# EAGLE design polarshield3.0d (EAGLE 7.2.0)
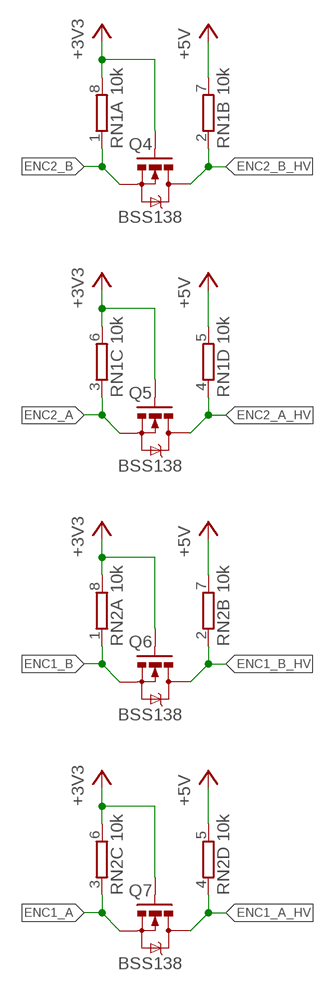
[diagram p0: schematic, sheet 1, part 1 of 2]
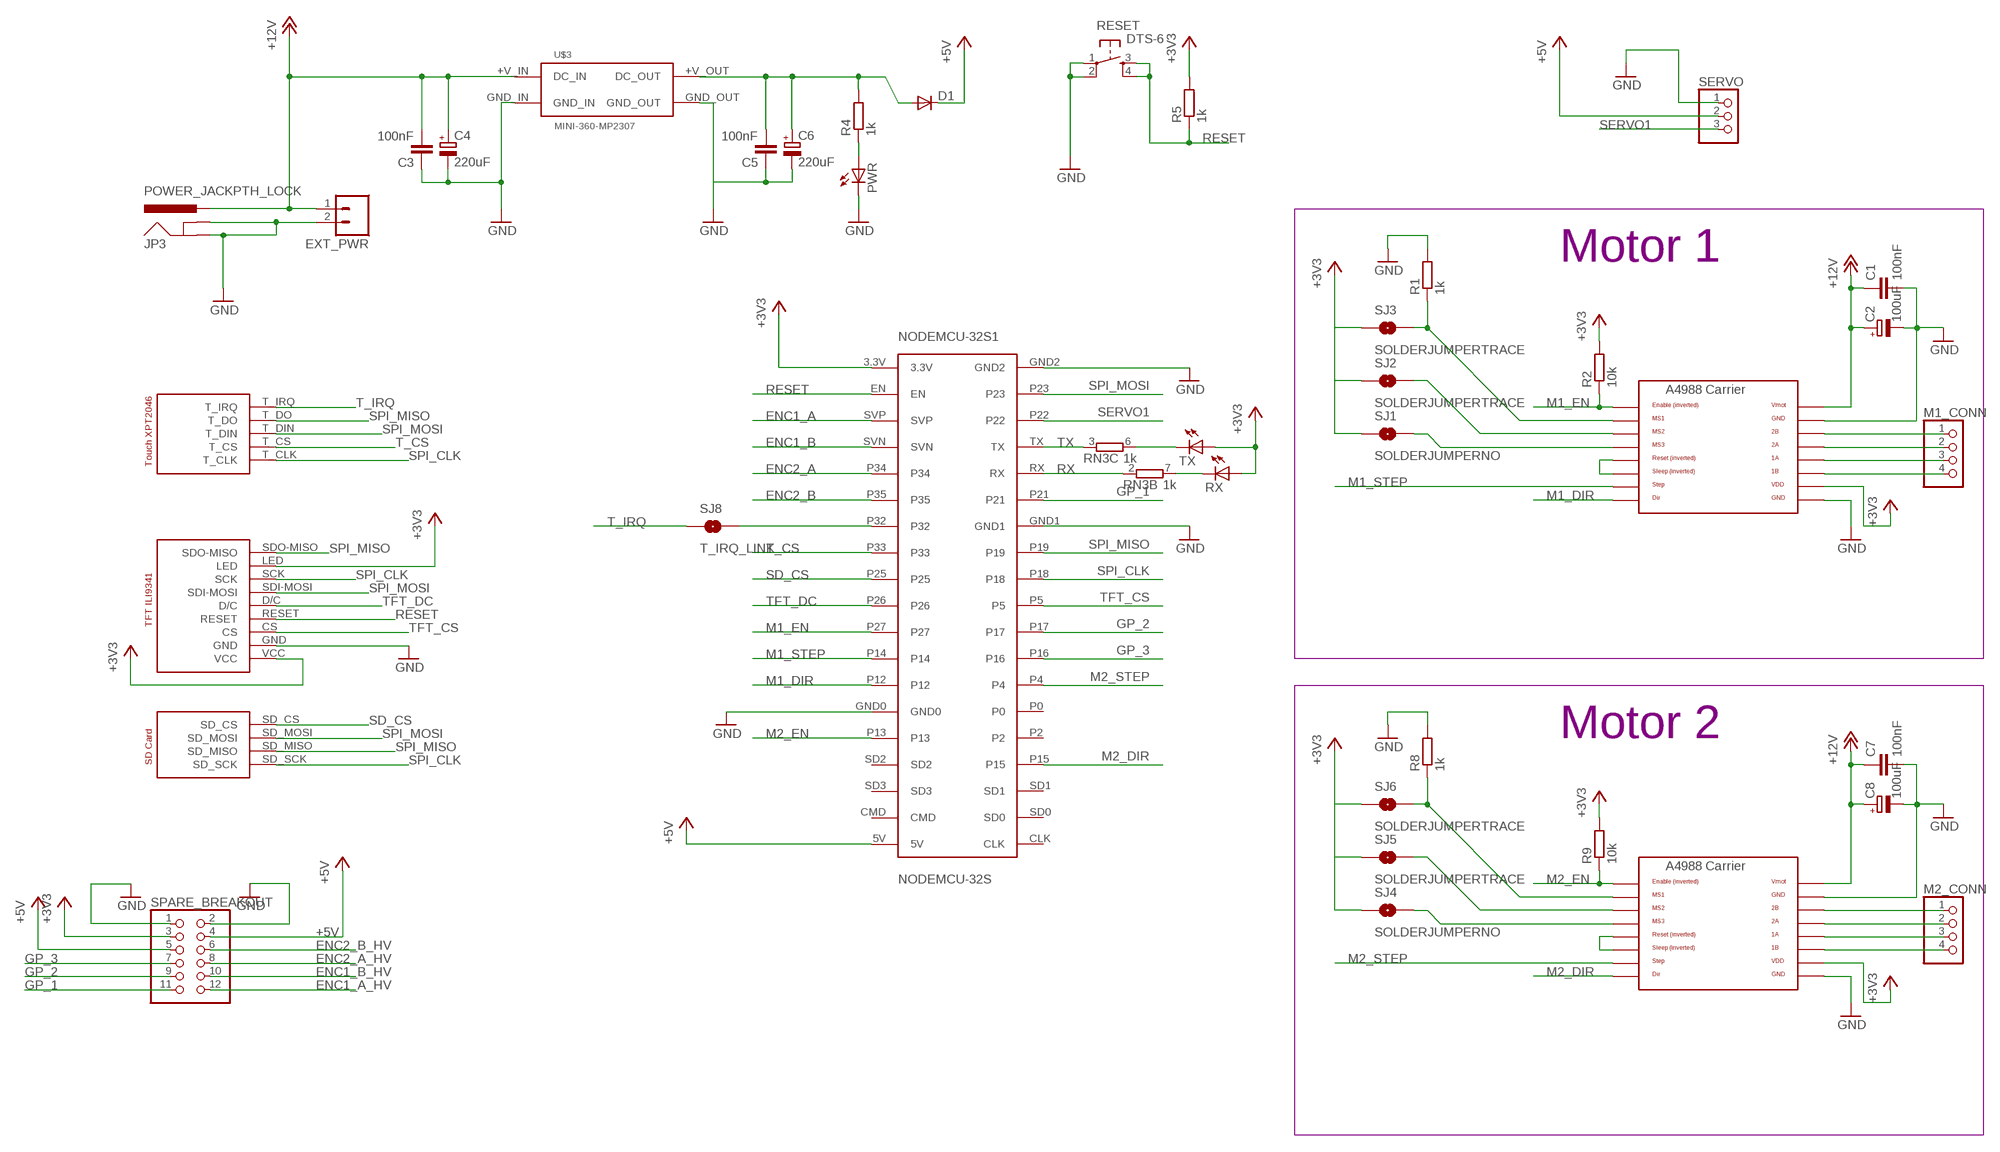
[diagram p1: schematic, sheet 1, part 2 of 2]

## Parts
C1  100nF  C-EUC0805  [C0805]
C2  100uF  CPOL-EU153CLV-0605  [153CLV-0605]
C3  100nF  C-EUC0805  [C0805]
C4  220uF  CPOL-EU153CLV-0605  [153CLV-0605]
C5  100nF  C-EUC0805  [C0805]
C6  220uF  CPOL-EU153CLV-0605  [153CLV-0605]
C7  100nF  C-EUC0805  [C0805]
C8  100uF  CPOL-EU153CLV-0605  [153CLV-0605]
D1  DIODE-DO214BA  [DO214BA]
EXT_PWR  M02PTH  [1X02]
JP3  POWER_JACKPTH_LOCK  [POWER_JACK_PTH_LOCK]
M1_CONN  PINHD-1X4/90  [1X04/90]
M2_CONN  PINHD-1X4/90  [1X04/90]
MOTOR_1  A4988BREAKOUT  [A4988BREAKOUT]
MOTOR_2  A4988BREAKOUT  [A4988BREAKOUT]
NODEMCU-32S1  NODEMCU-32S  [NODEMCU-32S]
PWR  LEDCHIPLED_0805  [CHIPLED_0805]
Q4  BSS138  MOSFET-NCHANNELSMD  [SOT23-3]
Q5  BSS138  MOSFET-NCHANNELSMD  [SOT23-3]
Q6  BSS138  MOSFET-NCHANNELSMD  [SOT23-3]
Q7  BSS138  MOSFET-NCHANNELSMD  [SOT23-3]
R1  1k  R-EU_M0805  [M0805]
R2  10k  R-EU_M0805  [M0805]
R4  1k  R-EU_M0805  [M0805]
R5  1k  R-EU_M0805  [M0805]
R8  1k  R-EU_M0805  [M0805]
R9  10k  R-EU_M0805  [M0805]
RESET  DTS-6  [DTS-6]
RN1  10k  4R-NEXB38V  [EXB38V]
RN2  10k  4R-NEXB38V  [EXB38V]
RN3  1k  4R-NEXB38V  [EXB38V]
RX  LEDCHIPLED_0805  [CHIPLED_0805]
SERVO  PINHD-1X3/90  [1X03/90]
SJ1  SOLDERJUMPERNO  [SJ_2S-NO]
SJ2  SOLDERJUMPERTRACE  [SJ_2S-TRACE]
SJ3  SOLDERJUMPERTRACE  [SJ_2S-TRACE]
SJ4  SOLDERJUMPERNO  [SJ_2S-NO]
SJ5  SOLDERJUMPERTRACE  [SJ_2S-TRACE]
SJ6  SOLDERJUMPERTRACE  [SJ_2S-TRACE]
SJ8  T_IRQ_LINK  SOLDERJUMPERNO  [SJ_2S-NO]
SPARE_BREAKOUT  PINHD-2X6  [2X06]
TX  LEDCHIPLED_0805  [CHIPLED_0805]
U$2  2.4_TFT_SPI_TOUCH_SD  [2.4_TFT_SPI_TOUCH_SD]
U$3  MINI-360-MP2307  [MINI-360-MP2307]

## Nets
+3V3 [VCC]: MOTOR_1.VDD MOTOR_2.VDD NODEMCU-32S1.3.3V Q4.1(G) Q5.1(G) Q6.1(G) Q7.1(G) R2.2 R5.2 R9.2 RN1.6 RN1.8 RN2.6 RN2.8 RX.A SJ1.1 SJ2.1 SJ3.1 SJ4.1 SJ5.1 SJ6.1 SPARE_BREAKOUT.3 TX.A U$2.LED U$2.VCC
+5V [VCC]: D1.C NODEMCU-32S1.5V RN1.5 RN1.7 RN2.5 RN2.7 SERVO.2 SPARE_BREAKOUT.4 SPARE_BREAKOUT.5
+12V [VMOT]: C1.1 C2.+ C3.2 C4.+ C7.1 C8.+ EXT_PWR.1 JP3.PWR MOTOR_1.VMOT MOTOR_2.VMOT U$3.+V_IN(DC_IN)
ENC1_A: NODEMCU-32S1.SVP Q7.2(S) RN2.3
ENC1_A_HV: Q7.3(D) RN2.4 SPARE_BREAKOUT.12
ENC1_B: NODEMCU-32S1.SVN Q6.2(S) RN2.1
ENC1_B_HV: Q6.3(D) RN2.2 SPARE_BREAKOUT.10
ENC2_A: NODEMCU-32S1.P34 Q5.2(S) RN1.3
ENC2_A_HV: Q5.3(D) RN1.4 SPARE_BREAKOUT.8
ENC2_B: NODEMCU-32S1.P35 Q4.2(S) RN1.1
ENC2_B_HV: Q4.3(D) RN1.2 SPARE_BREAKOUT.6
GND [GND]: C1.2 C2.- C3.1 C4.- C5.1 C6.- C7.2 C8.- EXT_PWR.2 JP3.GND JP3.GNDBREAK MOTOR_1.GND MOTOR_1.GND@0(GND) MOTOR_2.GND MOTOR_2.GND@0(GND) NODEMCU-32S1.GND0 NODEMCU-32S1.GND1 NODEMCU-32S1.GND2 PWR.C R1.2 R8.2 RESET.1 RESET.2 SERVO.1 SPARE_BREAKOUT.1 SPARE_BREAKOUT.2 U$2.GND U$3.GND_IN U$3.GND_OUT
GP_1: NODEMCU-32S1.P21 SPARE_BREAKOUT.11
GP_2: NODEMCU-32S1.P17 SPARE_BREAKOUT.9
GP_3: NODEMCU-32S1.P16 SPARE_BREAKOUT.7
M1_DIR: MOTOR_1.DIR NODEMCU-32S1.P12
M1_EN: MOTOR_1.EN NODEMCU-32S1.P27 R2.1
M1_STEP: MOTOR_1.STEP NODEMCU-32S1.P14
M2_DIR: MOTOR_2.DIR NODEMCU-32S1.P15
M2_EN: MOTOR_2.EN NODEMCU-32S1.P13 R9.1
M2_STEP: MOTOR_2.STEP NODEMCU-32S1.P4
N$1: NODEMCU-32S1.P32 SJ8.2
N$2: MOTOR_1.RST MOTOR_1.SLP(SLEEP)
N$3: MOTOR_1.MS3 SJ1.2
N$4: MOTOR_1.MS2 SJ2.2
N$5: MOTOR_1.MS1 R1.1 SJ3.2
N$7 [VCC]: C5.2 C6.+ D1.A R4.2 U$3.+V_OUT(DC_OUT)
N$8: PWR.A R4.1
N$9: MOTOR_2.MS3 SJ4.2
N$10 [VMOT]: M1_CONN.1 MOTOR_1.2B
N$11 [VMOT]: M1_CONN.2 MOTOR_1.2A
N$12 [VMOT]: M1_CONN.3 MOTOR_1.1A
N$13 [VMOT]: M1_CONN.4 MOTOR_1.1B
N$14: RN3.6 TX.C
N$15: RN3.7 RX.C
N$16: MOTOR_2.MS2 SJ5.2
N$17: MOTOR_2.MS1 R8.1 SJ6.2
N$18: MOTOR_2.RST MOTOR_2.SLP(SLEEP)
N$20 [VMOT]: M2_CONN.1 MOTOR_2.2B
N$21 [VMOT]: M2_CONN.2 MOTOR_2.2A
N$22 [VMOT]: M2_CONN.3 MOTOR_2.1A
N$23 [VMOT]: M2_CONN.4 MOTOR_2.1B
RESET: NODEMCU-32S1.EN R5.1 RESET.3 RESET.4 U$2.RESET
RX: NODEMCU-32S1.RX RN3.2
SD_CS: NODEMCU-32S1.P25 U$2.SD_CS
SERVO1: NODEMCU-32S1.P22 SERVO.3
SPI_CLK: NODEMCU-32S1.P18 U$2.SCK U$2.SD_SCK U$2.T_CLK
SPI_MISO: NODEMCU-32S1.P19 U$2.SD_MISO U$2.SDO-MISO U$2.T_DO
SPI_MOSI: NODEMCU-32S1.P23 U$2.SD_MOSI U$2.SDI-MOSI U$2.T_DIN
T_CS: NODEMCU-32S1.P33 U$2.T_CS
T_IRQ: SJ8.1 U$2.T_IRQ
TFT_CS: NODEMCU-32S1.P5 U$2.CS
TFT_DC: NODEMCU-32S1.P26 U$2.D/C
TX: NODEMCU-32S1.TX RN3.3
Unconnected: NODEMCU-32S1.CLK NODEMCU-32S1.CMD NODEMCU-32S1.P0 NODEMCU-32S1.P2 NODEMCU-32S1.SD0 NODEMCU-32S1.SD1 NODEMCU-32S1.SD2 NODEMCU-32S1.SD3 RN3.1 RN3.4 RN3.5 RN3.8

## Notes on the sheet
- Motor 1
- Motor 2

## Library data of the parts
C1 C3 C5 C7 = resistor:C-EU: CAPACITOR, European symbol
C2 C4 C6 C8 = resistor:CPOL-EU: POLARIZED CAPACITOR, European symbol
D1 = diode:DIODE-: DIODE
EXT_PWR = SparkFun-Connectors:M02: Standard 2-pin 0.1" header. Use with - straight break away headers ( PRT-00116) - right angle break away headers (PRT-00553) - swiss pins (PRT-00743) - machine pins (PRT-00117) - female headers (PRT-00115) Molex polarized connector foot print use with: PRT-08233 with associated crimp pins and housings. 2.54_SCREWTERM for use with PRT-10571. 3.5mm Screw Terminal footprints for PRT-08084 5mm Screw Terminal footprints for use with PRT-08432
JP3 = SparkFun-Connectors:POWER_JACK: Power Jack This is the standard 5.5mm barrel jack for power. The PTH is the most common, proven, reliable, footprint. The Slot footprint only works if the mill layer is transmitted to the PCB fab house so be warned. Mating wall wart : TOL-00298 (and others); PROD_ID: CONN-08197; SF_ID: PRT-00119
M1_CONN M2_CONN = pinhead:PINHD-1X4: PIN HEADER
MOTOR_1 MOTOR_2 = sandy:A4988BREAKOUT
NODEMCU-32S1 = sandy:NODEMCU-32S
PWR RX TX = polargraph3:LED: LED OSRAM: - CHIPLED LG R971, LG N971, LY N971, LG Q971, LY Q971, LO R971, LY R971 LH N974, LH R974 LS Q976, LO Q976, LY Q976 LO Q996 - Hyper CHIPLED LW Q18S LB Q993, LB Q99A, LB R99A - SideLED LS A670, LO A670, LY A670, LG A670, LP A670 LB A673, LV A673, LT A673, LW A673 LH A674 LY A675 LS A676, LA A676, LO A676, LY A676, LW A676 LS A679, LY A679, LG A679 - Hyper Micro SIDELED® LS Y876, LA Y876, LO Y876, LY Y876 LT Y87S - SmartLED LW L88C, LW L88S LB L89C, LB L89S, LG L890 LS L89K, LO L89K, LY L89K LS L896, LA L896, LO L896, LY L896 - TOPLED LS T670, LO T670, LY T670, LG T670, LP T670 LSG T670, LSP T670, LSY T670, LOP T670, LYG T670 LG T671, LOG T671, LSG T671 LB T673, LV T673, LT T673, LW T673 LH T674 LS T676, LA T676, LO T676, LY T676, LB T676, LH T676, LSB T676, LW T676 LB T67C, LV T67C, LT T67C, LS T67K, LO T67K, LY T67K, LW E67C LS E67B, LA E67B, LO E67B, LY E67B, LB E67C, LV E67C, LT E67C LW T67C LS T679, LY T679, LG T679 LS T770, LO T770, LY T770, LG T770, LP T770 LB T773, LV T773, LT T773, LW T773 LH T774 LS E675, LA E675, LY E675, LS T675 LS T776, LA T776, LO T776, LY T776, LB T776 LHGB T686 LT T68C, LB T68C - Hyper Mini TOPLED® LB M676 - Mini TOPLED Santana® LG M470 LS M47K, LO M47K, LY M47K Source: http://www.osram.convergy.de LUXEON: - LUMILED® LXK2-PW12-R00, LXK2-PW12-S00, LXK2-PW14-U00, LXK2-PW14-V00 LXK2-PM12-R00, LXK2-PM12-S00, LXK2-PM14-U00 LXK2-PE12-Q00, LXK2-PE12-R00, LXK2-PE12-S00, LXK2-PE14-T00, LXK2-PE14-U00 LXK2-PB12-K00, LXK2-PB12-L00, LXK2-PB12-M00, LXK2-PB14-N00, LXK2-PB14-P00, LXK2-PB14-Q00 LXK2-PR12-L00, LXK2-PR12-M00, LXK2-PR14-Q00, LXK2-PR14-R00 LXK2-PD12-Q00, LXK2-PD12-R00, LXK2-PD12-S00 LXK2-PH12-R00, LXK2-PH12-S00 LXK2-PL12-P00, LXK2-PL12-Q00, LXK2-PL12-R00 Source: www.luxeon.com KINGBRIGHT: KA-3528ASYC Source: www.kingbright.com
Q4-Q7 = SparkFun:MOSFET-NCHANNEL
R1 R2 R4 R5 R8 R9 = resistor:R-EU_: RESISTOR, European symbol
RESET = switch-tact:DTS-6
RN1-RN3 = resistor-dil:4R-N: Array Chip Resistor Source: RS Component / Phycomp; OC_FARNELL: unknown; OC_NEWARK: unknown
SERVO = pinhead:PINHD-1X3: PIN HEADER
SJ1-SJ6 = polargraph3:SOLDERJUMPER: Solder Jumper Standard SMD solder jumper. Used to automate production. Two varients : Normally Open and Normally Closed are the same, but have different paste layers. NC will have a large amount of paste and should jumper during reflow.
SJ8 = SparkFun-Retired:SOLDERJUMPER: Solder Jumper Standard SMD solder jumper. Used to automate production. Two varients : Normally Open and Normally Closed are the same, but have different paste layers. NC will have a large amount of paste and should jumper during reflow.
SPARE_BREAKOUT = pinhead:PINHD-2X6: PIN HEADER
U$2 = polargraph3:2.4_TFT_SPI_TOUCH_SD
U$3 = polargraph3:MINI-360-MP2307

## Net classes
0 signal: width 0.254 mm, drill 0.152 mm, clearance 0.203 mm
1 VMOT: width 1.118 mm, drill 0.152 mm, clearance 0.305 mm
2 VCC: width 0.61 mm, drill 0.152 mm, clearance 0.203 mm
3 GND: width 0.305 mm, drill 0.152 mm, clearance 0.203 mm

## Board
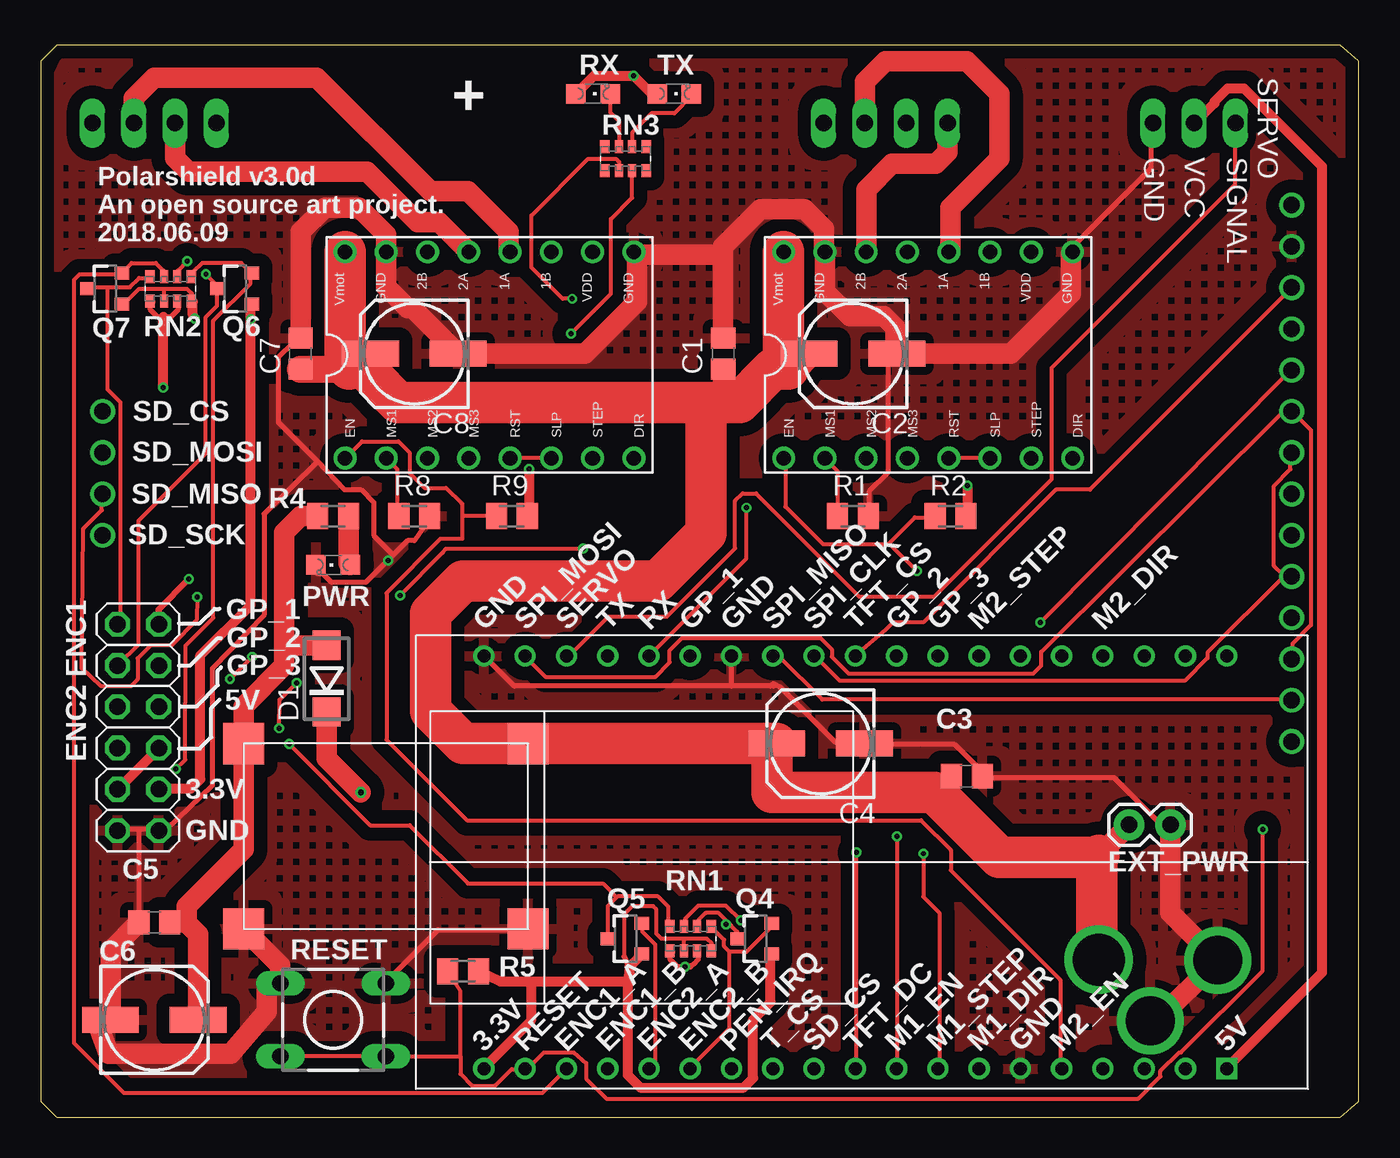
[diagram p2: board, top side]
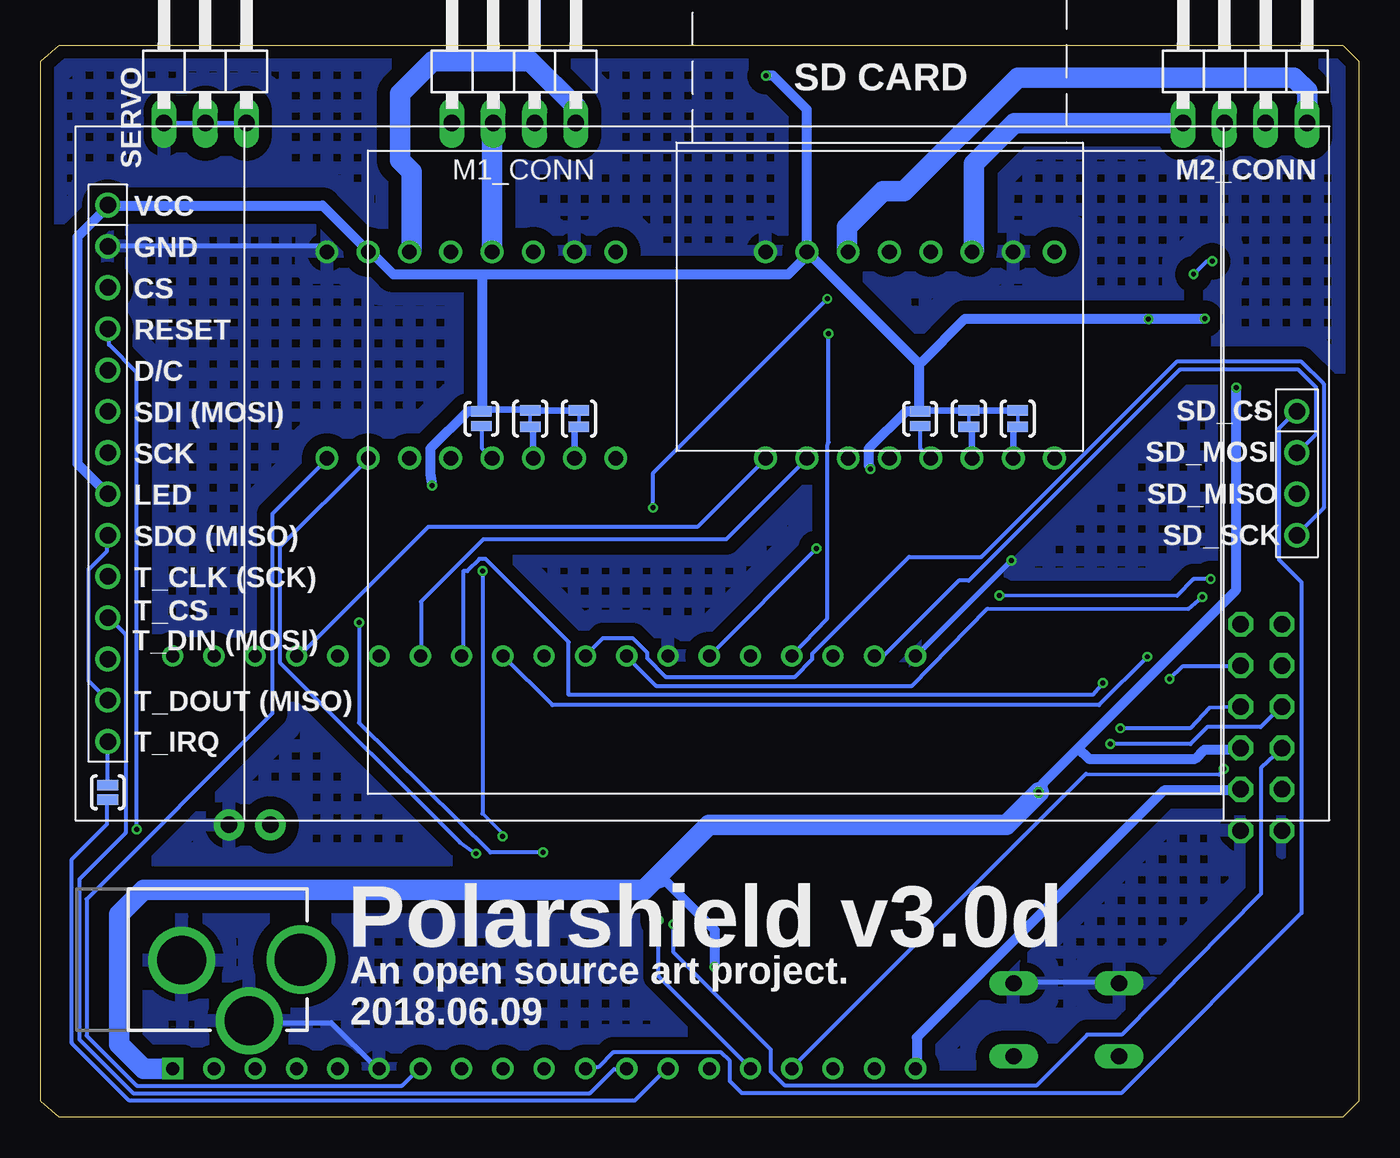
[diagram p3: board, bottom side, seen from below]

Size 81.13 x 66 mm. Coordinates in mm from the lower left corner, seen from the top.
Outline: 0,1 1,0 80,0 81.13,1 81.13,65 80,66 1,66 0,65 0,1
Copper layers (1*16): Top 0.035mm / dielectric 1.5mm / Bottom 0.035mm
Design rules "SeeedStudio_2layer_DRU_no_angle_20140221 *": minimum track width 6mil, minimum drill 12mil, track to track 6mil, track to pad 6mil, pad to pad 6mil, via to via 6mil, smd to smd 0mil, copper to edge 10mil, drill to drill 10mil, minimum pad ring 10mil, minimum via ring 6mil, stop-mask expansion 2mil, vias tented up to drill 100mil, thermal gap 20mil

### Footprints (pad centres in the part's own frame; a part is rotated, then mirrored left to right if it is on the bottom)
C0805 = smd 1.3 x 1.5: 1 -0.95,0; 2 0.95,0
153CLV-0605 = smd 3.5 x 1.6: + 2.7,0; - -2.7,0
DO214BA = smd 1.8 x 1.7: A 2.05,0; C -2.05,0
1X02 = drill 1.016 pad 1.88: 1 0,0; 2 2.54,0
POWER_JACK_PTH_LOCK = drill 2.997 pad 4.115: GND 0.025,6.557; GNDBREAK 3.762,10.7 | drill 3.2 pad 4.115: PWR 0,13.878
1X04/90 = drill 1.016 long: 1 -3.81,-3.81; 2 -1.27,-3.81; 3 1.27,-3.81; 4 3.81,-3.81
A4988BREAKOUT = drill 0.9: 1A 8.89,1.27; 1B 11.43,1.27; 2A 6.35,1.27; 2B 3.81,1.27; DIR 16.51,-11.43; EN -1.27,-11.43; GND 16.51,1.27; GND@0 1.27,1.27; MS1 1.27,-11.43; MS2 3.81,-11.43; MS3 6.35,-11.43; RST 8.89,-11.43; SLP 11.43,-11.43; STEP 13.97,-11.43; VDD 13.97,1.27; VMOT -1.27,1.27
NODEMCU-32S = drill 0.8: 3.3V 0,45.72; CLK 25.4,0; CMD 0,2.54; EN 0,43.18; GND0 0,12.7; GND1 25.4,30.48; GND2 25.4,45.72; P0 25.4,12.7; P2 25.4,10.16; P4 25.4,15.24; P5 25.4,22.86; P12 0,15.24; P13 0,10.16; P14 0,17.78; P15 25.4,7.62; P16 25.4,17.78; P17 25.4,20.32; P18 25.4,25.4; P19 25.4,27.94; P21 25.4,33.02; P22 25.4,40.64; P23 25.4,43.18; P25 0,25.4; P26 0,22.86; P27 0,20.32; P32 0,30.48; P33 0,27.94; P34 0,35.56; P35 0,33.02; RX 25.4,35.56; SD0 25.4,2.54; SD1 25.4,5.08; SD2 0,7.62; SD3 0,5.08; SVN 0,38.1; SVP 0,40.64; TX 25.4,38.1 | drill 0.8 square: 5V 0,0
CHIPLED_0805 = smd 1.2 x 1.2: A 0,-1.05; C 0,1.05
SOT23-3 = smd 0.8 x 0.9: 1 -0.95,-1; 2 0.95,-1; 3 0,1.1
M0805 = smd 1.3 x 1.6: 1 -0.95,0; 2 0.95,0
DTS-6 = drill 1 long: 1 -3.25,2.25; 2 3.25,2.25; 3 -3.25,-2.25; 4 3.25,-2.25
EXB38V = smd 0.6 x 0.8: 1 -1.275,-0.75; 4 1.275,-0.75; 5 1.275,0.75; 8 -1.275,0.75 | smd 0.5 x 0.8: 2 -0.4,-0.75; 3 0.4,-0.75; 6 0.4,0.75; 7 -0.4,0.75
1X03/90 = drill 1.016 long: 1 -2.54,-3.81; 2 0,-3.81; 3 2.54,-3.81
SJ_2S-NO = smd 0.635 x 1.27: 1 -0.45,0; 2 0.45,0
SJ_2S-TRACE = smd 0.635 x 1.27: 1 -0.508,0; 2 0.508,0
2X06 = drill 1.016 octagon: 1 -6.35,-1.27; 2 -6.35,1.27; 3 -3.81,-1.27; 4 -3.81,1.27; 5 -1.27,-1.27; 6 -1.27,1.27; 7 1.27,-1.27; 8 1.27,1.27; 9 3.81,-1.27; 10 3.81,1.27; 11 6.35,-1.27; 12 6.35,1.27
2.4_TFT_SPI_TOUCH_SD = drill 1.016: CS 9.93,2; D/C 15.01,2; GND 7.39,2; LED 22.63,2; RESET 12.47,2; SCK 20.09,2; SD_CS 17.55,75.18; SD_MISO 22.63,75.18; SD_MOSI 20.09,75.18; SD_SCK 25.17,75.18; SDI-MOSI 17.55,2; SDO-MISO 25.17,2; T_CLK 27.71,2; T_CS 30.25,2; T_DIN 32.79,2; T_DO 35.33,2; T_IRQ 37.87,2; VCC 4.85,2
MINI-360-MP2307 = smd 2.54 x 2.54: +V_IN -1,-1; +V_OUT 16.5,-1; GND_IN -1,10.4; GND_OUT 16.5,10.4

### Placement (x,y rotation side)
C1  42,47 90 top
C2  50,47 180 top
C3  57,21 180 top
C4  48,23 180 top
C5  7,12 0 top
C6  7,6 0 top
C7  16,47 90 top
C8  23,47 180 top
D1  17.6,27 90 top
EXT_PWR  67,18 0 top
JP3  79,9.7 270 bottom
M1_CONN  52,65 0 bottom
M2_CONN  7,65 0 bottom
MOTOR_1  47,52 0 top
MOTOR_2  20,52 0 top
NODEMCU-32S1  73,3 90 top
PWR  18,34 90 top
Q4  44,11 90 top
Q5  36,11 90 top
Q6  12,51 90 top
Q7  4,51 90 top
R1  50,37 0 top
R2  56,37 0 top
R4  18,37 180 top
R5  26,9 0 top
R8  23,37 0 top
R9  29,37 0 top
RESET  18,6 0 top
RN1  40,11 180 top
RN2  8,51 180 top
RN3  36,59 0 top
RX  34,63 270 top
SERVO  71,65 0 bottom
SJ1  54,43 270 bottom
SJ2  51,43 270 bottom
SJ3  48,43 270 bottom
SJ4  27,43 270 bottom
SJ5  24,43 270 bottom
SJ6  21,43 270 bottom
SJ8  77,20 270 bottom
SPARE_BREAKOUT  6,24 90 top
TX  39,63 270 top
U$2  79,61 270 bottom
U$3  29,22 180 top

### Tracks (layer width: path | path; a pad name or v marks a point on that pad's centre or on a via)
+3V3  (via drill 0.3)
  Top 0.254: RN1.8 41.27,10.72 41,11 39.5,11 | 7.6,51 6.08,51 5.03,49.95 | 7.6,51 9,51 9.28,50.73 | RN2.6 7.6,51 | 39.5,11 38.2,11 37.9,11.3 37.9,12.8 37.7,13 36.4,13 35.9,12.5 35.9,9.9 | RN1.6 39.6,10.9 39.5,11 | 36.2,9.2 36.2,9.03 36.23,9
  Top 0.305: 41.38,10.17 RN1.8 | 9.28,50.73 RN2.8 | 35.9,9.9 36.2,9.2
  Top 0.61: 34.06,64.12 33.03,63.09 RX.A 34.05,64.1 v36.5,64.1 37.6,63 TX.A | 37.95,63.09 TX.A | v30.06,39.89 30.06,37.03 R9.2 | 37.83,62.75 TX.A | RN2.8 9.37,50.18 9.37,49.38 v9.49,49.15 | 5.03,49.95 Q7.1 | v57.04,38.89 57.04,37.03 R2.2 | 36.13,8.34 36.23,9 36.23,9.26 36.92,9.94 Q5.1 | 36.13,8.34 36.13,2.62 36.92,1.83 43.26,1.83 43.85,2.42 43.85,6.01 44.92,7.09 44.92,9.94 Q4.1 | 36.13,8.34 30.18,8.34 | 30.18,8.34 30.18,5.94 27.32,3.09 NODEMCU-32S1.3.3V | 12.92,49.03 12.92,31.52 9.83,28.43 9.83,20.8 9.26,20.23 7.32,20.23 SPARE_BREAKOUT.3 | 12.92,49.03 12.92,49.95 Q6.1 | v12.94,49.13 12.92,49.03 | 30.18,8.34 28.29,8.34 R5.2
  Bottom 0.406: SJ6.1 SJ5.1 27,43.51 SJ4.1 | SJ3.1 SJ2.1 51,43.55 53.95,43.55
  Bottom 0.61: 27.09,46.41 27.09,43.55 SJ4.1 27.32,43.43 27.89,43.43 30.18,41.15 30.18,40.12 30.06,40.01 v30.06,39.89 | 27.09,46.41 33.95,53.26 MOTOR_2.VDD | 61.04,53.38 | 61.04,53.38 63.78,56.12 76.92,56.12 U$2.VCC 77.15,55.89 78.87,54.18 78.87,40.23 77.04,38.41 U$2.LED | 61.04,53.38 MOTOR_1.VDD 60.69,53.15 59.44,51.89 53.95,51.89 | 53.95,51.89 35.12,51.89 33.98,53.03 34.18,53.03 MOTOR_2.VDD | 53.95,51.89 53.95,43.55 SJ1.1 54.29,43.43 54.86,43.43 57.15,41.15 57.15,39.6 v57.04,38.89 | 13.14,49.15 24.23,49.15 26.86,46.52 27.09,46.41 | 13.14,49.15 v9.49,49.15 | NODEMCU-32S1.3.3V 27.2,3.09 27.2,4.92 12,20.12 7.32,20.12 SPARE_BREAKOUT.3 | v12.94,49.13 13.14,49.15 | MOTOR_2.VDD 33.97,62.03 36.06,64.12 36.09,64.1 v36.5,64.1
+5V  (via drill 0.3, 0.35, 0.6)
  Top 0.305: 38.75,10.17 38.75,9.72 39.2,9.26 40.01,9.26 40.18,9.43 | 40.18,9.43 40.46,9.72 40.46,10.17 RN1.7 | 6.74,50.18 6.74,49.72 7.2,49.26 7.54,49.26 8,49.26 8.46,49.72 8.46,50.18 RN2.7 | v39.65,9.26 40.18,9.43
  Top 0.61: SPARE_BREAKOUT.4 4.8,20.23 7.2,22.63 SPARE_BREAKOUT.5 | 38.75,10.17 RN1.5 | 6.74,50.18 RN2.5 | v7.54,44.92 7.54,49.26 | v71.09,61.27 72.24,62.41 72.24,62.52 73.04,63.32 74.07,63.32 78.87,58.52 78.87,8.91 73.04,3.09 NODEMCU-32S1.5V
  Top 1.27: D1.C 17.6,22.1 v19.7,20
  Bottom 0.61: v7.54,44.92 7.54,32.46 17.29,22.72 | 17.29,22.72 19.43,20.57 v19.7,20 | v39.65,9.26 39.65,11.53 42.63,14.52 44,14 | v71.09,61.27 SERVO.2 | 17.29,22.72 16.63,22.06 10.07,22.06 9.5,22.63 7.32,22.63 SPARE_BREAKOUT.5
  Bottom 1.27: NODEMCU-32S1.5V 74.8,3 76.3,4.5 76.3,12.5 74.8,14 44,14 40,18 21.7,18 v19.7,20
+12V
  Top 1.118: C3.2 56.01,20.92 55.89,20.8 55,20
  Top 1.27: C1.1 42,44 | JP3.PWR 65.12,16.12 EXT_PWR.1
  Top 1.676: 20.3,45.7 C8.+ 19.35,46.05 19,46.05 C7.1 | C2.+ 46.35,46.05 46,46.05 45.73,46.32
  Top 2.54: MOTOR_2.VMOT 18.73,46.32 19,46.05 | 20.3,45.7 22,44 40.95,44 | MOTOR_1.VMOT 45.73,46.32 | 40.95,44 40.95,35.95 38,33 26,33 24,31 24,25 26,23 U$3.+V_IN C4.+ 45,22.7 45,20 55,20 59,16 65,16 | 46,46.05 45.05,46.05 43,44 42,44 40.95,44 | 65.12,16.12 65,16 | 65,16 65,10
ENC1_A
  Top 0.254: RN2.3 7.54,51.78 7.54,52.12 7.09,52.58 5.6,52.58 5.03,52.01 Q7.2 4.92,51.89 2.4,51.89 2.06,51.55 2.06,4.57 5.14,1.49 30.86,1.49 32.35,2.97 NODEMCU-32S1.SVP
ENC1_A_HV
  Top 0.254: 4.12,51.09 2.97,51.09 Q7.3 | 4.12,51.09 5.49,51.09 6.06,51.66 6.63,51.66 RN2.4 | 4.12,51.09 4.12,44.81 4.92,44.01 4.92,30.52 4.8,30.4 SPARE_BREAKOUT.12
ENC1_B  (via drill 0.3)
  Top 0.254: RN2.1 9.37,51.78 9.37,52.01 9.94,52.58 12.34,52.58 12.92,52.01 Q6.2 12.92,51.89 12.92,51.32 10.63,49.03 10.63,30.75 8.91,29.03 8.9,22 v8.31,21.45
  Bottom 0.254: v8.31,21.45 8.6,21.1 16.8,21.14 34.86,3.09 NODEMCU-32S1.SVN
ENC1_B_HV  (via drill 0.3)
  Top 0.254: v9.03,52.69 8.46,52.12 8.46,51.78 RN2.2 | v10.17,51.89 10.97,51.09 Q6.3 10.86,50.98 10.86,49.95 10.17,49.26 10.17,40.86 6.03,36.72 6.03,29.12 4.8,27.89 SPARE_BREAKOUT.10
  Bottom 0.254: v9.03,52.69 9.37,52.69 v10.17,51.89
ENC2_A  (via drill 0.3)
  Top 0.254: v43.09,12.12 42.18,13.03 40.46,13.03 39.66,12.23 39.66,11.77 RN1.3 | Q5.2 37.03,11.89 37.03,11.43 37.83,10.63 37.83,3.43 37.49,3.09 NODEMCU-32S1.P34
  Bottom 0.254: v43.09,12.12 43.09,8.69 37.49,3.09 NODEMCU-32S1.P34
ENC2_A_HV  (via drill 0.3)
  Top 0.254: 34.98,11.32 34.98,11.09 Q5.3 | RN1.4 38.63,11.77 38.63,12.97 38,13.6 35.5,13.6 35.45,13.55 | v15.29,22.97 20.29,17.97 22.72,17.97 26.3,14.4 34.6,14.4 35.45,13.55 | 34.86,11.32 Q5.3 | 35.45,13.55 34.9,13 Q5.3
  Bottom 0.254: v15.29,22.97 10.37,22.97 9.33,24.02 6.04,24.02 4.8,25.26 SPARE_BREAKOUT.8
ENC2_B
  Top 0.254: 42.41,10.17 42.06,10.52 42.06,10.93 41.38,11.62 41.38,11.66 RN1.1 | 42.41,10.17 43.43,10.17 44.92,11.66 44.92,11.89 Q4.2 | 42.41,10.17 42.41,5.49 40.01,3.09 NODEMCU-32S1.P35
ENC2_B_HV  (via drill 0.3)
  Top 0.254: 42.23,12.06 42.86,11.43 42.86,11.09 Q4.3 | 42.23,12.06 41.72,12.57 40.92,12.57 40.46,12.12 40.46,11.77 RN1.2 | v42.18,11.89 42.18,12 42.23,12.06
  Bottom 0.254: v42.18,11.89 42.18,10.14 36.19,4.16 36.19,2.81 35.32,1.94 19.86,1.94 16.72,5.09 14.6,5.09 6.03,13.76 6.03,21.5 4.8,22.63 SPARE_BREAKOUT.6
GND  (via drill 0.3, 0.6)
  Top 0.305: R1.2 50.98,37.03 50.98,38.51 52.13,39.66 52.13,46.53 C2.- | v68.35,61.15 68.35,58.41 63.78,53.84 MOTOR_1.GND | 6.06,17.72 7.2,17.72 SPARE_BREAKOUT.1 7.32,17.72 7.77,17.72 10.56,20.4 10.56,27.63 13.74,30.92 13.74,37.15 17.06,40.36 | 6.06,17.72 4.8,17.72 SPARE_BREAKOUT.2 | U$3.GND_IN 29.95,11.54 24.46,11.54 21.26,8.34 RESET.2 | 6.06,17.72 6.06,12.57 C5.1 | 21.7,34.62 22.6,35.5 23,35.5 24,36.92 R8.2 | 21.7,34.62 21.43,34.35 | 21.43,34.35 20,32.92 17.9,32.92 17.37,33.45 17.03,33.45 PWR.C | 21.7,34.62 20.5,35.82 20.5,37.85 19.72,38.63 18.69,38.63 17.06,40.36 | 17.06,40.36 14.63,42.79 14.63,46.75 15.54,47.66 C7.2 | 45.12,26.55 44.9,26.55 | 44.9,26.55 42.5,26.55 | 42.5,26.55 29.15,26.55 27.35,28.35 27.32,28.35 NODEMCU-32S1.GND2 | EXT_PWR.2 68.92,18.06 66.06,20.92 58.06,20.92 C3.1 57.84,21.03 57.84,21.37 56.24,22.97 50.75,22.97 C4.- 50.63,23.09 48.91,23.09 45.5,26.5 45.1,26.7 44.9,26.55 | v21.39,34.28 21.49,34.29 21.43,34.35 | 42.52,28.35 42.5,28.35 42.5,26.55
  Top 1.27: C1.2 42,53.1 | 42,53.1 36.68,53.1 MOTOR_2.GND 36.7,53.08 36.7,50.2 33.5,47 C8.- 22.9,49.8 22.6,49.8 21.27,51.13 MOTOR_2.GND@0 21.27,54.33 19.6,56 17.5,56 16,54.5 C7.2 | 42,53.1 42,53.6 44.3,55.9 47,55.9 48.2,54.7 48.2,53.34 MOTOR_1.GND@0 48.27,50.83 49.8,49.3 51.9,49.3 52.6,48.6 52.6,47.1 C2.- 59.7,47 63.4,50.7 63.4,53.16 MOTOR_1.GND | EXT_PWR.2 69.54,12.58 JP3.GND 68.71,5.94 JP3.GNDBREAK | C5.1 4.3,10.25 C6.- 3.6,5.7 3.6,5.5 4.2,3.9 11.7,3.9 13.9,6.5 13.9,7.8 14.35,8.25 RESET.1 14.75,9.35 U$3.GND_OUT
  Bottom 0.305: RESET.1 14.86,8.34 21.14,8.34 RESET.2 | v68.35,61.15 SERVO.1 | U$2.GND 76.92,53.61 63.78,53.61 63.55,53.38 MOTOR_1.GND | NODEMCU-32S1.GND0 60.35,3.09 60.49,3.09 63.24,5.83 68.24,5.83 JP3.GNDBREAK | v21.39,34.28 27.2,28.46 NODEMCU-32S1.GND2
  pour Bottom (isolate 0.813, hatched): 0.6,64.7 0.6,1.6 1.7,0.5 79.5,0.5 80.6,1.6 80.6,64.1 79.4,65.3 1.2,65.3
  pour Top (isolate 0.813, hatched): 0.8,63.6 0.8,0.5 79.7,0.5 80.6,1.4 80.6,64.5 79.6,65.5 1.7,65.5
GP_1  (via drill 0.3)
  Top 0.254: v33.38,35 24.95,35 24.75,34.75 v22.12,32.12 | 7.38,30.38 SPARE_BREAKOUT.11
  Top 0.406: v9.12,33.12 7.27,31.27 SPARE_BREAKOUT.11
  Bottom 0.254: v33.38,35 39.88,28.5 NODEMCU-32S1.P21 | v9.12,33.12 10.18,33.12 11.2,32.1 v22.12,32.12
GP_2  (via drill 0.3)
  Top 0.254: v11.65,26.98 v13.03,28.35
  Bottom 0.254: v13.03,28.35 16,25.38 49.62,25.38 52.62,28.38 NODEMCU-32S1.P17 | v11.65,26.98 10.88,27.75 7.38,27.75 SPARE_BREAKOUT.9
GP_3  (via drill 0.3)
  Top 0.254: v14.68,23.95 14.7,25.7 v15.75,26.73
  Bottom 0.254: v15.75,26.73 16.38,26 48.62,26 48.62,29.25 53.75,34.38 54.12,34.38 54.88,33.62 55.12,33.62 55.12,28.5 NODEMCU-32S1.P16 | v14.68,23.95 10.38,23.95 9.2,25.2 7.38,25.25 SPARE_BREAKOUT.7
M1_DIR
  Bottom 0.254: NODEMCU-32S1.P12 57.84,2.97 57.86,2.97 58.89,1.94 75.21,1.94 78.3,5.03 78.3,13.43 66.86,24.86 66.86,37.15 63.55,40.46 MOTOR_1.DIR
M1_EN  (via drill 0.3)
  Top 0.254: 52.22,35.33 52.16,35.28 48.15,35.28 45.83,37.59 45.83,40.46 MOTOR_1.EN | 52.22,35.33 53.81,36.92 54.98,36.92 R2.1 | 52.22,35.33 v53.94,33.62 | NODEMCU-32S1.P27 52.69,3.09 v52.69,17.29 v52.7,17.3
  Bottom 0.203: v52.7,17.3 52.7,17.46 53.94,18.7
  Bottom 0.254: v53.94,33.62 53.94,18.7
M1_STEP  (via drill 0.3)
  Top 0.254: v54.32,16.23 54.32,13.58 55.3,12.6 55.32,3.09 NODEMCU-32S1.P14
  Bottom 0.254: 60.92,40.58 MOTOR_1.STEP 61.04,40.46 66.41,35.09 66.41,28 55.32,16.92 v54.32,16.23
M2_DIR
  Bottom 0.254: NODEMCU-32S1.P15 65.38,28.46 65.15,28.46 57.28,36.33 40.7,36.33 36.58,40.46 MOTOR_2.DIR
M2_EN
  Top 0.254: 25.95,37.03 28,37.03 R9.1 | 25.95,37.03 25.95,37.75 arc90 25.9,37.8 24.95,38.73 23.63,38.73 22.7,39.66 22.7,40.92 22.02,41.6 19.77,41.6 18.75,40.58 MOTOR_2.EN | 25.95,37.03 25.95,35.6 24.6,35.6 21.29,32.26 21.29,23.23 26.23,18.29 54.18,18.29 56.01,16.46 56.01,15.2 62.75,8.46 62.75,3.09 NODEMCU-32S1.P13
M2_STEP
  Bottom 0.254: 33.95,40.58 MOTOR_2.STEP 34.06,40.46 38.95,35.58 53.89,35.58 57.72,31.75 57.72,28.46 NODEMCU-32S1.P4
N$1
  Bottom 0.254: SJ8.2 77.04,19.55 77.04,18.06 79.21,15.89 79.21,4.57 75.67,1.03 44.58,1.03 42.63,2.97 NODEMCU-32S1.P32
N$2
  Top 0.254: MOTOR_1.RST 58.41,40.58 MOTOR_1.SLP
N$3
  Bottom 0.254: SJ1.2 53.95,42.52 53.95,41.15 53.38,40.58 MOTOR_1.MS3
N$4
  Bottom 0.406: SJ2.2 50.81,42.49 MOTOR_1.MS2
N$5
  Top 0.254: R1.1 49.03,37.03 49.03,39.78 48.35,40.46 MOTOR_1.MS1
  Bottom 0.406: SJ3.2 48.27,42.49 MOTOR_1.MS1
N$7
  Top 1.27: C6.+ 9.7,11.25 8.97,11.97 | 8.97,11.97 C5.2 | D1.A 15.05,29.05 15,29 | 15,29 15,27.8 12.5,25.3 U$3.+V_OUT 12.5,16.5 9,13 9,12 8.97,11.97 | R4.2 16,37 15,36 15,29
N$8
  Top 1.27: R4.1 18.95,34.1 PWR.A
N$9
  Bottom 0.254: SJ4.2 26.98,42.52 26.98,41.15 26.4,40.58 MOTOR_2.MS3
N$10
  Top 1.016: M1_CONN.1
  Top 1.27: MOTOR_1.2B 50.81,57.11 52.4,58.7 55.1,58.7 55.8,59.4 M1_CONN.1
N$11
  Bottom 1.016: 53.35,61.11 M1_CONN.2
  Bottom 1.27: MOTOR_1.2A 53.35,61.11
N$12
  Top 1.27: M1_CONN.3 50.73,63.73 52,65 57,65 59,63 59,59 56,56 56,53.38 MOTOR_1.1A
N$13
  Bottom 1.27: M1_CONN.4 48.19,62.19 51,65 57,65 59,63 59,58.9 58.3,58.2 58.3,53.4 MOTOR_1.1B
N$14
  Top 0.254: TX.C 40.01,62.98 40.01,62.8 39,61.8 37.6,61.8 36.4,60.6 RN3.6
N$15
  Top 0.254: 34.98,62.98 RX.C 35.05,61.85 35.6,61.3 RN3.7
N$16
  Bottom 0.406: SJ5.2 23.81,42.49 MOTOR_2.MS2
N$17
  Top 0.254: R8.1 21.95,37.03 21.95,39.89 21.37,40.46 MOTOR_2.MS1
  Bottom 0.406: SJ6.2 21.27,42.49 MOTOR_2.MS1
N$18
  Top 0.254: MOTOR_2.RST 28.92,40.58 31.32,40.58 MOTOR_2.SLP
N$20
  Bottom 1.27: M2_CONN.1 21.21,61.19 23.7,58.7 23.7,53.38 MOTOR_2.2B
N$21
  Top 1.27: M2_CONN.2 8.27,59.03 9.1,58.2 20.1,58.2 23.2,55.1 24.52,55.1 MOTOR_2.2A
N$22
  Top 1.27: M2_CONN.3 5.73,62.73 7,64 17,64 24,57 26.3,57 28.8,54.5 28.8,53.36 MOTOR_2.1A
N$23
  Bottom 1.27: M2_CONN.4 3.19,63.19 4,64 21,64 28,57 29.3,57 31.5,54.8 31.5,53.34 MOTOR_2.1B
RESET  (via drill 0.3)
  Top 0.254: 25.83,3.77 21.26,3.77 RESET.4 21.14,3.77 14.86,3.77 RESET.3 | 25.83,3.77 25.83,2.67 26.56,1.94 27.96,1.94 28.99,2.97 29.72,2.97 NODEMCU-32S1.EN 29.95,2.97 30.98,4 32.8,4 33.58,3.33 33.58,2.39 34.82,1.14 67.55,1.14 68.92,2.52 68.92,2.86 70.07,4 70.18,4 75.21,9.03 v75.21,17.73 | 25.83,3.77 25.83,7.78 R5.1
  Bottom 0.254: v75.21,17.73 75.21,45.83 76.92,47.55 76.92,48.46 U$2.RESET
RX  (via drill 0.3)
  Top 0.254: v43.43,37.52 43.43,34.4 37.49,28.46 NODEMCU-32S1.RX | v32.72,50.38 32.12,50.38 30.2,52.3 30.2,55.5 33.7,59 35.4,59 35.6,58.8 RN3.2
  Bottom 0.254: v32.72,50.38 43.43,39.66 v43.43,37.52
SD_CS
  Bottom 0.254: NODEMCU-32S1.P25 47.55,3.09 46.81,3.09 45.89,4 39.25,4 38.72,3.47 38.72,2.23 37.98,1.49 14.63,1.49 3.54,12.57 3.54,32.95 4.92,34.32 4.92,42.41 3.89,43.43 U$2.SD_CS
SERVO1  (via drill 0.6)
  Top 0.254: v73.5,61.15 73.5,57.41 62.21,46.12 62.21,39.26 54.98,32.03 50.41,32.03 44.04,38.4 43.2,38.4 42.75,37.95 42.75,35.02 38.53,30.8 34.93,30.8 32.59,28.46 32.46,28.46 NODEMCU-32S1.P22
  Bottom 0.254: v73.5,61.15 SERVO.3
SPI_CLK
  Top 0.254: NODEMCU-32S1.P18 47.66,28.35 47.71,28.35 49.19,26.86 70.41,26.86 71.81,28.26 71.81,28.6 76.47,33.26 76.92,33.26 U$2.T_CLK 76.47,33.38 75.89,33.95 75.89,38.86 76.92,39.89 76.92,40.8 U$2.SCK
  Bottom 0.254: U$2.SD_SCK 3.77,35.89 3.77,35.91 2.17,37.51 2.17,45.15 3.53,46.51 11.21,46.51 23.23,34.49 27.69,34.49 33.63,28.55 33.63,28.2 34.72,27.12 42.66,27.12 43.81,28.26 43.81,28.6 44.69,29.49 46.52,29.49 47.55,28.46 NODEMCU-32S1.P18
SPI_MISO  (via drill 0.3)
  Top 0.254: NODEMCU-32S1.P19 45.15,28.35 45.48,28.35 48.11,25.72 76.92,25.72 U$2.T_DO | v9.64,32.02 9.6,30.6 8.07,29.05 6.77,29.05 5.97,28.25 5.97,26.96 5.54,26.53 3.74,26.53 2.53,27.65 2.63,36.23 3.77,37.38 3.77,38.29 U$2.SD_MISO
  Bottom 0.254: U$2.SDO-MISO 77.04,35.78 77.04,34.86 78.18,33.72 78.18,26.86 77.04,25.72 U$2.T_DO | v9.64,32.02 10.5,31.3 22.86,31.32 27.52,26.56 43.25,26.56 45.03,28.35 NODEMCU-32S1.P19
SPI_MOSI
  Top 0.254: U$2.T_DIN 77.04,28.23 77.04,29.15 78.18,30.29 78.18,42.29 77.04,43.43 U$2.SDI-MOSI 76.92,43.43 76.47,43.43 61.58,28.65 61.58,27.8 61.09,27.32 49.72,27.32 48.69,28.35 48.69,28.8 48.01,29.49 39.46,29.49 38.72,28.75 38.72,28 37.83,27.12 31.06,27.12 29.83,28.35 NODEMCU-32S1.P23
  Bottom 0.254: NODEMCU-32S1.P23 29.72,28.46 29.19,28.46 24.62,33.03 24,33.03 11.02,46.02 3.73,46.02 2.63,44.92 2.63,42.06 3.77,40.92 U$2.SD_MOSI
T_CS
  Bottom 0.254: NODEMCU-32S1.P33 45.15,2.97 45.83,2.97 47.32,1.49 75.44,1.49 78.75,4.8 78.75,14.66 75.89,17.52 75.89,29.72 76.92,30.75 U$2.T_CS
T_IRQ
  Bottom 0.254: SJ8.1 77.04,20.46 77.04,23.09 U$2.T_IRQ
TFT_CS
  Top 0.254: NODEMCU-32S1.P5 50.18,28.46 52,30 52.46,30.46 54.32,30.46 62.49,38.63 64.58,38.63 76.92,50.98 U$2.CS
TFT_DC  (via drill 0.3)
  Top 0.254: v61.54,30.46 76.92,45.95 U$2.D/C | NODEMCU-32S1.P26 50.18,3.09 50.18,16.28 v50.2,16.3
  Bottom 0.254: v61.54,30.46 61.54,24.29 53.45,16.3 v50.2,16.3
TX  (via drill 0.3)
  Top 0.254: v32.63,48.23 35.09,50.69 35.09,55.29 36.4,56.6 RN3.3
  Bottom 0.254: v32.63,48.23 32.63,41.55 32.72,41.33 32.72,30.7 34.86,28.46 NODEMCU-32S1.TX

### Text on the board
_tsilk: SERVO | + | GND | VCC | SIGNAL | Polarshield v3.0d / An open source art project. / 2018.06.09 | SD_CS | SD_MOSI | SD_MISO | SD_SCK | GP_1 | GND | SPI_MOSI | SERVO | TX | RX | GP_1 | GND | SPI_MISO | SPI_CLK | TFT_CS | GP_2 | GP_3 | M2_STEP | M2_DIR | GP_2 | ENC1 | GP_3 | 5V | ENC2 | 3.3V | GND | 3.3V | RESET | ENC1_A | ENC1_B | ENC2_A | ENC2_B | PEN_IRQ | T_CS | SD_CS | TFT_DC | M1_EN | M1_STEP | M1_DIR | GND | M2_EN | 5V
_bsilk: SD CARD | VCC | GND | CS | RESET | D/C | SD_CS | SDI (MOSI) | SD_MOSI | SCK | SD_MISO | LED | SD_SCK | SDO (MISO) | T_CLK (SCK) | T_CS | T_DIN (MOSI) | T_DOUT (MISO) | T_IRQ | Polarshield v3.0d | An open source art project. / 2018.06.09